# Altium schematic sheet 槽形开关-CIU版本20260909.SchDoc
size 699 x 299 mm
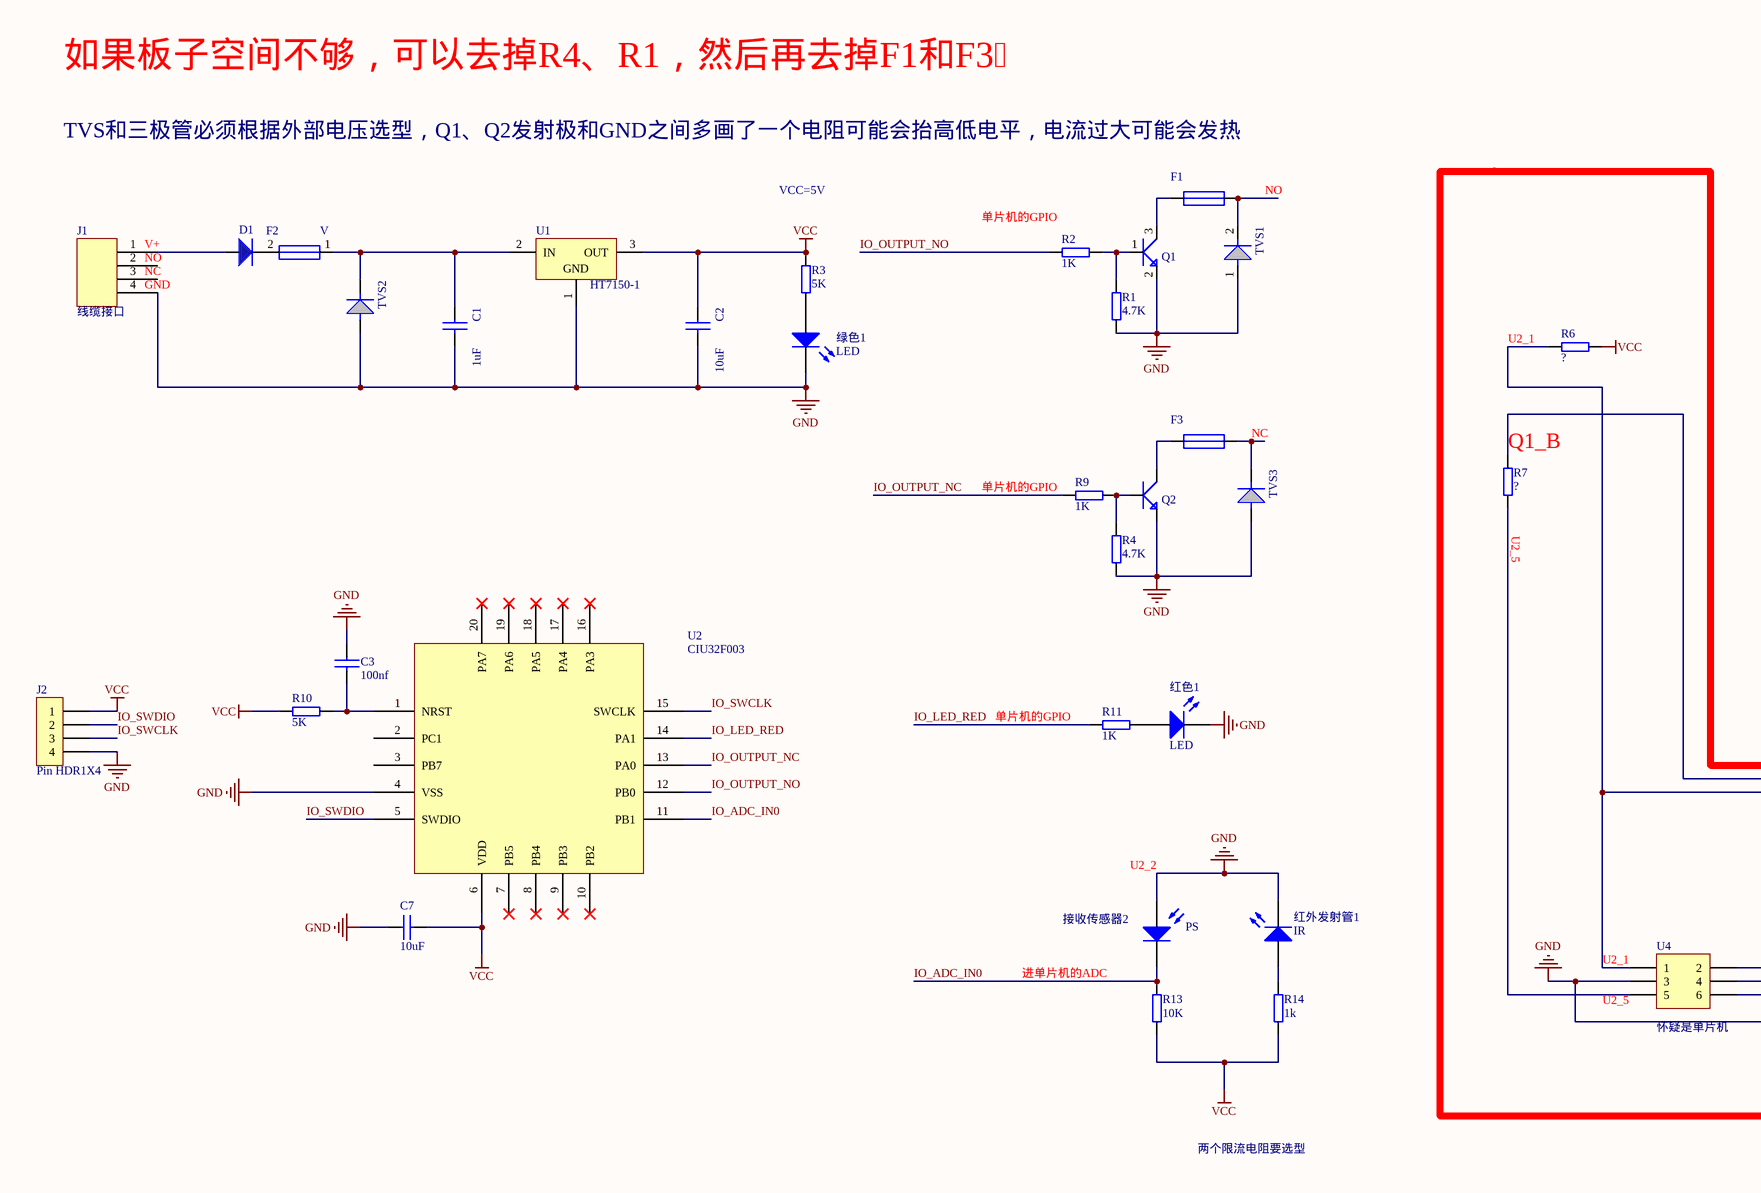
[diagram p0: 槽形开关-CIU版本20260909.SchDoc, left]
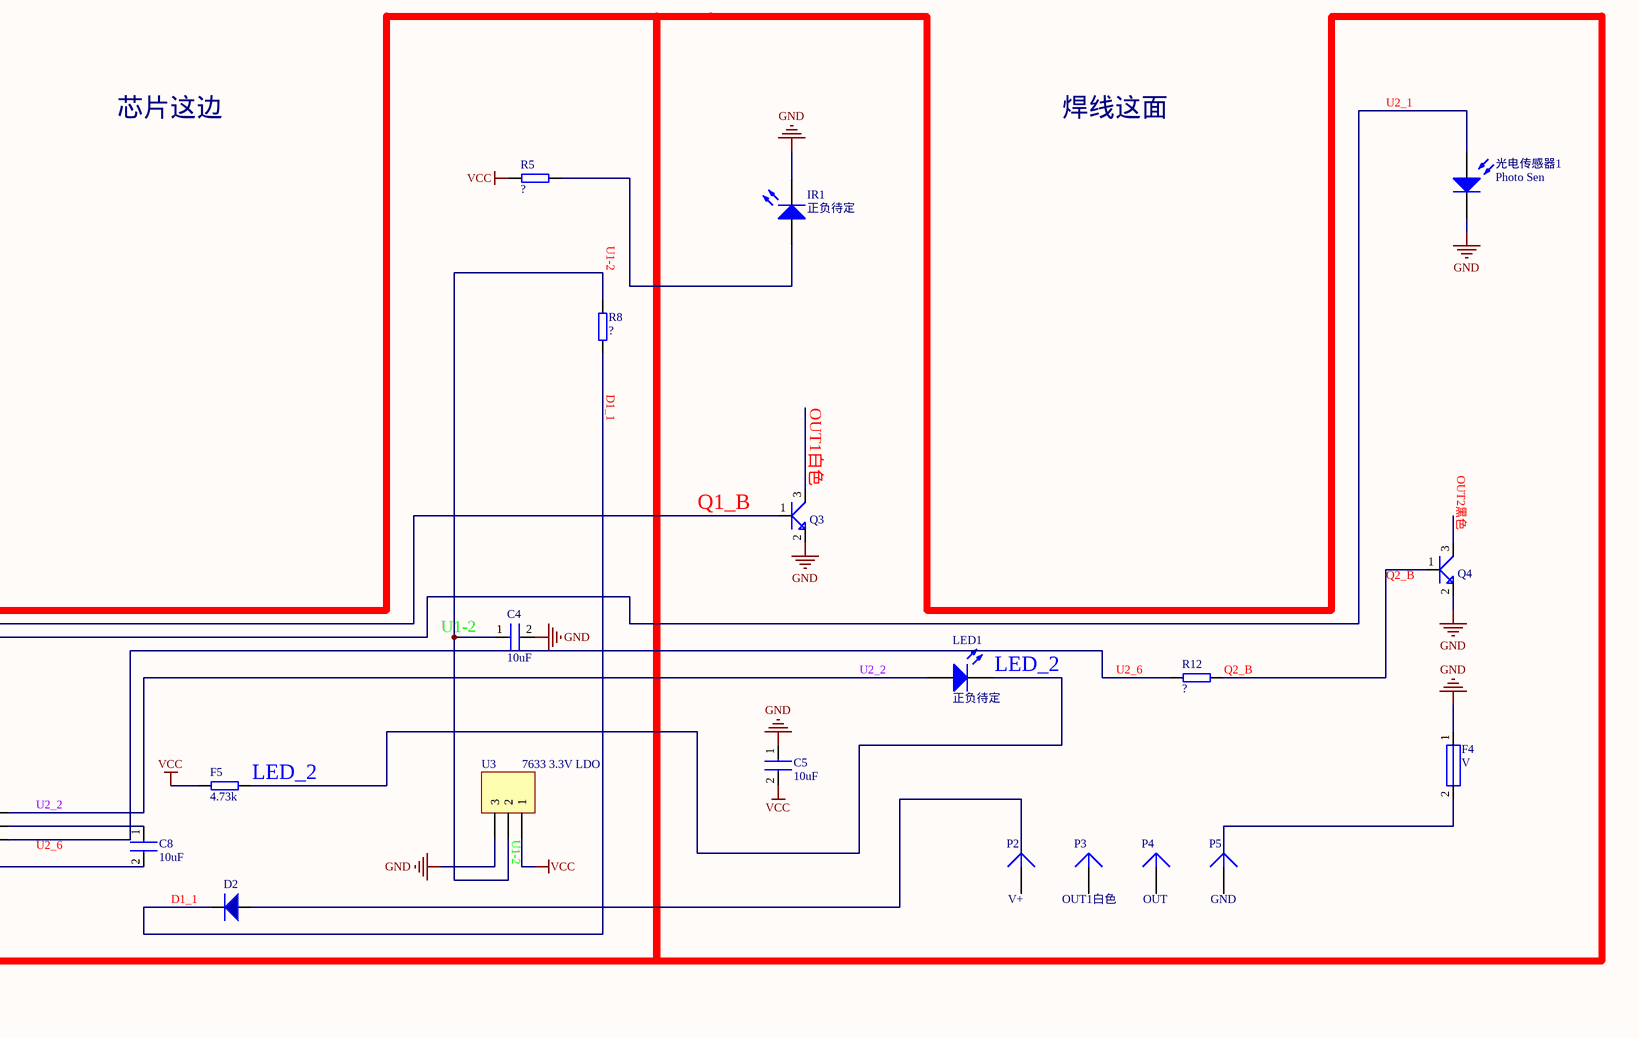
[diagram p1: 槽形开关-CIU版本20260909.SchDoc, right]

## Parts
C1  1uF  [1206]
C2  10uF  [1206]
C3  100nf  [1206]
C4  10uF
C5  10uF
C7  10uF  [1206]
C8  10uF
D1  (no value)
D2  (no value)
F1  V  [0805]  (value not drawn)
F2  V  [0805]
F3  (no value)  [0805]
F4  V  [0805]
F5  4.73k
IR1  正负待定  [LED-0]
J1  线缆接口  [SIP4]
J2  Pin HDR1X4  [Pin HDR1X4/2.54mm-S]
LED1  正负待定  [LED-0]
P2  V+  [PIN1]
P3  OUT1白色  [PIN1]
P4  OUT  [PIN1]
P5  GND  [PIN1]
Q1  2SC4617TLR  (value not drawn)
Q2  2SC4617TLR  (value not drawn)
Q3  2SC4617TLR  (value not drawn)
Q4  2SC4617TLR  (value not drawn)
R1  4.7K
R2  1K
R3  5K
R4  4.7K
R5  ?
R6  ?
R7  ?
R8  ?
R9  1K
R10  5K
R11  1K
R12  ?
R13  10K
R14  1k
TVS1  (no value)  [1206]
TVS2  M1  [1206]  (value not drawn)
TVS3  (no value)  [1206]
U1  HT7150-1  [SOT89N]
U2  CIU32F003
U3  7633 3.3V LDO  [HDR1X3]
U4  怀疑是单片机  [HDR2X3]
光电传感器1  Photo Sen  [PIN2]
接收传感器2  PS  [PIN2]
红外发射管1  IR  [LED-0]
红色1  LED  [LED-0]
绿色1  LED  [LED-0]

## Nets
GND: C1.2 C2.2 C3.1 C4.2 C5.1 C7.1 C8.2 F4.1 IR1.2(K) J1.4 J2.4 Q1.2(E) Q2.2(E) Q3.2(E) Q4.2(E) R1.2 R4.2 TVS1.1 TVS2.1 TVS3.1 U1.1(GND) U2.4(VSS) U3.3 U4.3 光电传感器1.2(K) 接收传感器2.1(A) 红外发射管1.2(K) 红色1.2(K) 绿色1.2(K)
VCC: C2.1 C5.2 C7.2 F5.2 J2.1 R3.1 R5.2 R6.1 R10.2 R13.1 R14.1 U1.3(OUT) U2.6(VDD) U3.1
IO_ADC_IN0: R13.2 U2.11(PB1) 接收传感器2.2(K)
IO_LED_RED: R11.1 U2.14(PA1)
IO_OUTPUT_NC: R9.1 U2.13(PA0)
IO_OUTPUT_NO: R2.1 U2.12(PB0)
IO_SWCLK: J2.3 U2.15(SWCLK)
IO_SWDIO: J2.2 U2.5(SWDIO)
NetC1_1: C1.1 F2.1 TVS2.2 U1.2(IN)
NetC3_2: C3.2 R10.1 U2.1(NRST)
NetC4_1: C4.1 R8.2 U3.2
NetC8_1: C8.1 U4.4
NetD1_1: D1.1 J1.1
NetD1_2: D1.2 F2.2
NetD2_2: D2.2 R8.1
NetF1_1: F1.1 TVS1.2
NetF1_2: F1.2 Q1.3(C)
NetF3_1: F3.1 TVS3.2
NetF3_2: F3.2 Q2.3(C)
NetF5_1: F5.1 LED1.2(K)
NetIR1_1: IR1.1(A) R5.1
NetLED1_1: LED1.1(A) U4.2
NetQ1_1: Q1.1(B) R1.1 R2.2
NetQ2_1: Q2.1(B) R4.1 R9.2
NetQ3_1: Q3.1(B) R7.2
NetQ4_1: Q4.1(B) R12.1
NetR3_2: R3.2 绿色1.1(A)
NetR6_2: R6.2 U4.1 光电传感器1.1(A)
NetR7_1: R7.1 U4.5
NetR11_2: R11.2 红色1.1(A)
NetR12_2: R12.2 U4.6
NetR14_2: R14.2 红外发射管1.1(A)

Not connected (* = marked no-connect by the designer): D2 1; F4 2; J1 2 3; P2 1; P3 1; P4 1; P5 1; Q3 3(C); Q4 3(C); U2 2(PC1) 3(PB7) 7(PB5)* 8(PB4)* 9(PB3)* 10(PB2)* 16(PA3)* 17(PA4)* 18(PA5)* 19(PA6)* 20(PA7)*

## Notes on the sheet
- 如果板子空间不够，可以去掉R4、R1，然后再去掉F1和F3
- TVS和三极管必须根据外部电压选型，Q1、Q2发射极和GND之间多画了一个电阻可能会抬高低电平，电流过大可能会发热
- VCC=5V
- NO
- (near J1) V+
- (near J1) NO
- (near J1) NC
- (near R2) 单片机的GPIO
- 芯片这边
- 焊线这面
- U2_1
- (near J1) GND
- (near R6) U2_1
- (near R8) U1-2
- NC
- (near R7) Q1_B
- (near R9) 单片机的GPIO
- (near R7) U2_5
- D1_1
- (near Q3) OUT1白色
- (near Q3) Q1_B
- (near Q4) OUT2黑色
- 单片机的GPIO
- (near Q4) Q2_B
- (near C4) U1-2
- U2_2
- (near LED1) LED_2
- (near R12) U2_6
- (near R12) Q2_B
- (near F5) LED_2
- 进单片机的ADC
- (near U4) U2_1
- (near U4) U2_5
- U2_6
- (near U3) U1-2
- (near D2) D1_1
- 两个限流电阻要选型

## Library data of the parts
C1-C3 C7 = CAP NP: Text Field1: 20; Text Field2: 10
C4 C5 C8 = CAP
D1 D2 = D
F1-F4 = FUSE_0: Text Field1: 30; Text Field2: 20
F5 R1-R14 = RES
IR1 LED1 红外发射管1 红色1 绿色1 = LED0: Typical INFRARED GaAs LED; Published: 8-Jun-2000; LatestRevisionDate: 08-Jul-2005; LatestRevisionNote: Mech Layer 1 removed.; PackageReference: LED-0; Publisher: Altium Limited; PackageDescription: LED; 2 Leads
J1 = 4H
P2-P5 = Plug: LatestRevisionDate: 17-Jul-2002; LatestRevisionNote: Re-released for DXP Platform.; Publisher: Altium Limited
Q1-Q4 = 2SC4617
TVS1-TVS3 = D1N3063_0: Text Field1: 20; Text Field2: 20
U1 = HT7530-1: 3.0V 100mA Low Power,  Low Dropout Voltage (LDO) Regulator; Published: 30-Mar-2007; DatasheetVersion: rev1.50, Jan-2006; PackageVersion: Jan-2006; PackageReference: SOT-89; Publisher: Altium Limited; PackageDescription: 3-Pin SOT-89 Package 1.5 mm Pitch, 4.1 mm Lead Span; Code_IPC: SOT89; ComponentLink1Description: Manufacturer Link; ComponentLink1URL: http://www.holtek.com/; ComponentLink2Description: Datasheet; ComponentLink2URL: http://www.holtek.com/pdf/consumer/75xx_1v150.pdf
U2 = CIU32F003F5Uxx
U3 = Header 3: Header, 3-Pin; LatestRevisionDate: 17-Jul-2002; LatestRevisionNote: Re-released for DXP Platform.; Publisher: Altium Limited
U4 = Header 3X2: Header, 3-Pin, Dual row; LatestRevisionDate: 17-Jul-2002; LatestRevisionNote: Re-released for DXP Platform.; Publisher: Altium Limited
光电传感器1 接收传感器2 = Photo Sen: Photosensitive Diode; Published: 24-Mar-1999; LatestRevisionDate: 17-Jul-2002; LatestRevisionNote: Re-released for DXP Platform.; PackageReference: PIN2; Publisher: Altium Limited